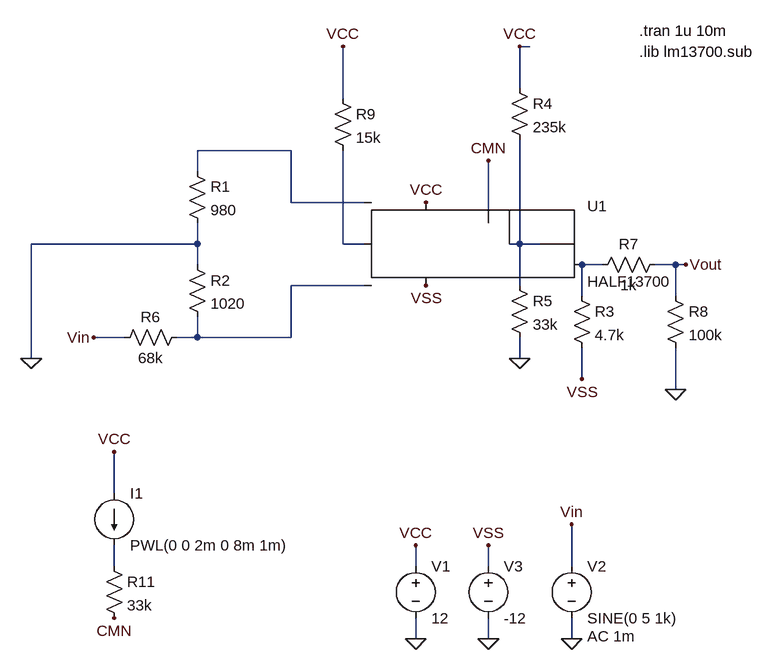
[diagram p0: schematic StandAlone13700.asc]
StandAlone13700.asc, the LTspice schematic file:
Version 4
SHEET 1 1048 948
WIRE 320 -160 304 -160
WIRE 304 -96 304 -160
WIRE 32 -80 32 -160
WIRE -48 0 -192 0
WIRE -192 32 -192 0
WIRE -48 80 -48 0
WIRE 64 80 -48 80
WIRE 256 112 256 16
WIRE -192 144 -192 112
WIRE -192 144 -448 144
WIRE 32 144 32 0
WIRE 64 144 32 144
WIRE 304 144 304 -16
WIRE 304 144 288 144
WIRE 336 144 304 144
WIRE -192 176 -192 144
WIRE 432 176 400 176
WIRE 544 176 512 176
WIRE 560 176 544 176
WIRE 64 208 -48 208
WIRE 304 208 304 144
WIRE 400 224 400 176
WIRE 544 224 544 176
WIRE -304 288 -352 288
WIRE -192 288 -192 256
WIRE -192 288 -224 288
WIRE -48 288 -48 208
WIRE -48 288 -192 288
WIRE -448 320 -448 144
WIRE 304 320 304 288
WIRE 400 352 400 304
WIRE 544 368 544 304
WIRE -320 528 -320 464
WIRE -320 640 -320 608
WIRE 144 640 144 608
WIRE 256 640 256 608
WIRE 384 640 384 576
WIRE 144 752 144 720
WIRE 256 752 256 720
WIRE 384 752 384 720
FLAG 144 752 0
FLAG 144 608 VCC
FLAG 160 208 VSS
FLAG 160 80 VCC
FLAG -320 464 VCC
FLAG 304 -160 VCC
FLAG 256 752 0
FLAG 256 608 VSS
FLAG 384 752 0
FLAG 304 320 0
FLAG 400 352 VSS
FLAG 384 576 Vin
FLAG -352 288 Vin
FLAG -448 320 0
FLAG 560 176 Vout
FLAG 544 368 0
FLAG 32 -160 VCC
FLAG 256 16 CMN
FLAG -320 720 CMN
SYMBOL LM13700 128 64 R0
SYMATTR InstName U1
SYMBOL voltage 144 624 R0
WINDOW 123 0 0 Left 2
WINDOW 39 0 0 Left 2
SYMATTR InstName V1
SYMATTR Value 12
SYMBOL res 384 208 R0
SYMATTR InstName R3
SYMATTR Value 4.7k
SYMBOL voltage 384 624 R0
WINDOW 123 24 124 Left 2
WINDOW 39 0 0 Left 2
SYMATTR Value2 AC 1m
SYMATTR InstName V2
SYMATTR Value SINE(0 5 1k)
SYMBOL current -320 528 R0
SYMATTR InstName I1
SYMATTR Value PWL(0 0 2m 0 8m 1m)
SYMBOL res 288 -112 R0
SYMATTR InstName R4
SYMATTR Value 235k
SYMBOL res 288 192 R0
SYMATTR InstName R5
SYMATTR Value 33k
SYMBOL voltage 256 624 R0
WINDOW 123 0 0 Left 2
WINDOW 39 0 0 Left 2
SYMATTR InstName V3
SYMATTR Value -12
SYMBOL res -208 16 R0
SYMATTR InstName R1
SYMATTR Value 980
SYMBOL res -208 160 R0
SYMATTR InstName R2
SYMATTR Value 1020
SYMBOL res -208 272 R90
WINDOW 0 0 56 VBottom 2
WINDOW 3 32 56 VTop 2
SYMATTR InstName R6
SYMATTR Value 68k
SYMBOL res 528 160 R90
WINDOW 0 0 56 VBottom 2
WINDOW 3 32 56 VTop 2
SYMATTR InstName R7
SYMATTR Value 1k
SYMBOL res 528 208 R0
SYMATTR InstName R8
SYMATTR Value 100k
SYMBOL res 16 -96 R0
SYMATTR InstName R9
SYMATTR Value 15k
SYMBOL res -336 624 R0
SYMATTR InstName R11
SYMATTR Value 33k
TEXT 488 -152 Left 2 !.lib lm13700.sub
TEXT 488 -184 Left 2 !.tran 1u 10m

The netlist it stands for:
* StandAlone13700.asc
XU1 N002 N005 N001 CMN N003 VCC VSS N003 N004 HALF13700
V1 VCC 0 12
R3 N004 VSS 4.7k
V2 Vin 0 SINE(0 5 1k) AC 1m
I1 VCC N006 PWL(0 0 2m 0 8m 1m)
R4 VCC N003 235k
R5 N003 0 33k
V3 VSS 0 -12
R1 N001 0 980
R2 0 N005 1020
R6 N005 Vin 68k
R7 Vout N004 1k
R8 Vout 0 100k
R9 VCC N002 15k
R11 N006 CMN 33k
.lib lm13700.sub
.tran 1u 10m
.backanno
.end